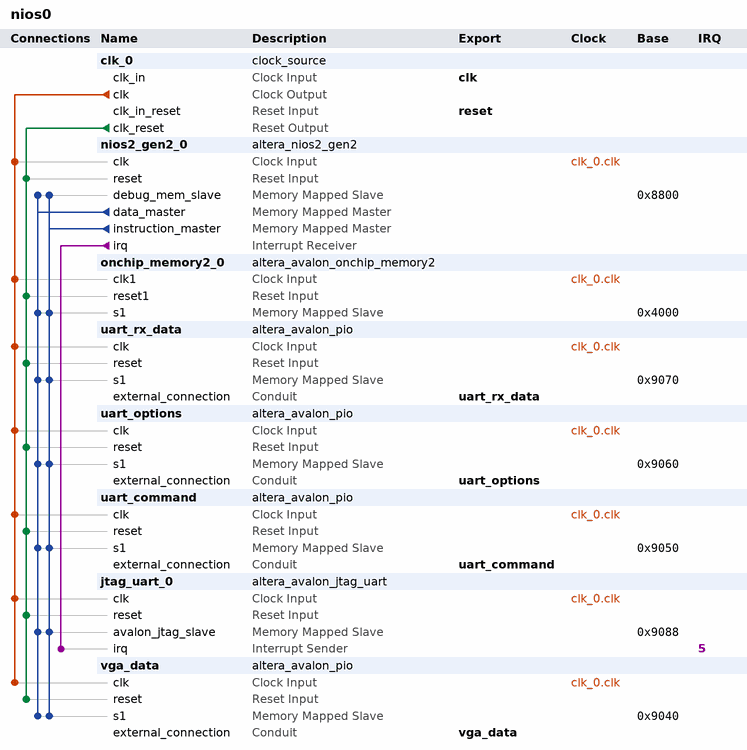
[diagram p0: system contents]
# Platform Designer (Qsys) system nios0, Cyclone IV E EP4CE30F23C7
# Parameters at their usual value, and those the tool derives, are not listed.
package require -exact qsys 15.0
create_system nios0
set_project_property DEVICE_FAMILY {Cyclone IV E}
set_project_property DEVICE EP4CE30F23C7

add_instance clk_0 clock_source 15.0
set_instance_parameter_value clk_0 clockFrequency 50000000

add_instance nios2_gen2_0 altera_nios2_gen2 15.0
set_instance_parameter_value nios2_gen2_0 dcache_size 2048
set_instance_parameter_value nios2_gen2_0 exceptionSlave onchip_memory2_0.s1
set_instance_parameter_value nios2_gen2_0 icache_size 4096
set_instance_parameter_value nios2_gen2_0 impl Tiny
set_instance_parameter_value nios2_gen2_0 resetSlave onchip_memory2_0.s1

add_instance onchip_memory2_0 altera_avalon_onchip_memory2 15.0
set_instance_parameter_value onchip_memory2_0 dataWidth 32
set_instance_parameter_value onchip_memory2_0 dualPort false
set_instance_parameter_value onchip_memory2_0 initMemContent true
set_instance_parameter_value onchip_memory2_0 initializationFileName onchip_mem.hex
set_instance_parameter_value onchip_memory2_0 memorySize 16384

add_instance uart_rx_data altera_avalon_pio 15.0
set_instance_parameter_value uart_rx_data direction Input
set_instance_parameter_value uart_rx_data width 8

add_instance uart_options altera_avalon_pio 15.0
set_instance_parameter_value uart_options direction Output
set_instance_parameter_value uart_options width 8

add_instance uart_command altera_avalon_pio 15.0
set_instance_parameter_value uart_command direction InOut
set_instance_parameter_value uart_command width 1

add_instance jtag_uart_0 altera_avalon_jtag_uart 15.0
set_instance_parameter_value jtag_uart_0 simInteractiveOptions NO_INTERACTIVE_WINDOWS

add_instance vga_data altera_avalon_pio 15.0
set_instance_parameter_value vga_data direction Output
set_instance_parameter_value vga_data width 24

# connections
add_connection clk_0.clk jtag_uart_0.clk clock
add_connection clk_0.clk nios2_gen2_0.clk clock
add_connection clk_0.clk onchip_memory2_0.clk1 clock
add_connection clk_0.clk uart_command.clk clock
add_connection clk_0.clk uart_options.clk clock
add_connection clk_0.clk uart_rx_data.clk clock
add_connection clk_0.clk vga_data.clk clock
add_connection clk_0.clk_reset jtag_uart_0.reset reset
add_connection clk_0.clk_reset nios2_gen2_0.reset reset
add_connection clk_0.clk_reset onchip_memory2_0.reset1 reset
add_connection clk_0.clk_reset uart_command.reset reset
add_connection clk_0.clk_reset uart_options.reset reset
add_connection clk_0.clk_reset uart_rx_data.reset reset
add_connection clk_0.clk_reset vga_data.reset reset
add_connection nios2_gen2_0.data_master jtag_uart_0.avalon_jtag_slave avalon
set_connection_parameter_value nios2_gen2_0.data_master/jtag_uart_0.avalon_jtag_slave baseAddress 0x9088
add_connection nios2_gen2_0.data_master nios2_gen2_0.debug_mem_slave avalon
set_connection_parameter_value nios2_gen2_0.data_master/nios2_gen2_0.debug_mem_slave baseAddress 0x8800
add_connection nios2_gen2_0.data_master onchip_memory2_0.s1 avalon
set_connection_parameter_value nios2_gen2_0.data_master/onchip_memory2_0.s1 baseAddress 0x4000
add_connection nios2_gen2_0.data_master uart_command.s1 avalon
set_connection_parameter_value nios2_gen2_0.data_master/uart_command.s1 baseAddress 0x9050
add_connection nios2_gen2_0.data_master uart_options.s1 avalon
set_connection_parameter_value nios2_gen2_0.data_master/uart_options.s1 baseAddress 0x9060
add_connection nios2_gen2_0.data_master uart_rx_data.s1 avalon
set_connection_parameter_value nios2_gen2_0.data_master/uart_rx_data.s1 baseAddress 0x9070
add_connection nios2_gen2_0.data_master vga_data.s1 avalon
set_connection_parameter_value nios2_gen2_0.data_master/vga_data.s1 baseAddress 0x9040
add_connection nios2_gen2_0.instruction_master jtag_uart_0.avalon_jtag_slave avalon
set_connection_parameter_value nios2_gen2_0.instruction_master/jtag_uart_0.avalon_jtag_slave baseAddress 0x9088
add_connection nios2_gen2_0.instruction_master nios2_gen2_0.debug_mem_slave avalon
set_connection_parameter_value nios2_gen2_0.instruction_master/nios2_gen2_0.debug_mem_slave baseAddress 0x8800
add_connection nios2_gen2_0.instruction_master onchip_memory2_0.s1 avalon
set_connection_parameter_value nios2_gen2_0.instruction_master/onchip_memory2_0.s1 baseAddress 0x4000
add_connection nios2_gen2_0.instruction_master uart_command.s1 avalon
set_connection_parameter_value nios2_gen2_0.instruction_master/uart_command.s1 baseAddress 0x9050
add_connection nios2_gen2_0.instruction_master uart_options.s1 avalon
set_connection_parameter_value nios2_gen2_0.instruction_master/uart_options.s1 baseAddress 0x9060
add_connection nios2_gen2_0.instruction_master uart_rx_data.s1 avalon
set_connection_parameter_value nios2_gen2_0.instruction_master/uart_rx_data.s1 baseAddress 0x9070
add_connection nios2_gen2_0.instruction_master vga_data.s1 avalon
set_connection_parameter_value nios2_gen2_0.instruction_master/vga_data.s1 baseAddress 0x9040
add_connection nios2_gen2_0.irq jtag_uart_0.irq interrupt
set_connection_parameter_value nios2_gen2_0.irq/jtag_uart_0.irq irqNumber 5

# exported interfaces
add_interface clk clock sink
set_interface_property clk EXPORT_OF clk_0.clk_in
add_interface reset reset sink
set_interface_property reset EXPORT_OF clk_0.clk_in_reset
add_interface uart_command conduit end
set_interface_property uart_command EXPORT_OF uart_command.external_connection
add_interface uart_options conduit end
set_interface_property uart_options EXPORT_OF uart_options.external_connection
add_interface uart_rx_data conduit end
set_interface_property uart_rx_data EXPORT_OF uart_rx_data.external_connection
add_interface vga_data conduit end
set_interface_property vga_data EXPORT_OF vga_data.external_connection

set_interconnect_requirement {$system} qsys_mm.clockCrossingAdapter HANDSHAKE
set_interconnect_requirement {$system} qsys_mm.enableEccProtection FALSE
set_interconnect_requirement {$system} qsys_mm.insertDefaultSlave FALSE
set_interconnect_requirement {$system} qsys_mm.maxAdditionalLatency 1

save_system nios0.qsys
